# EAGLE schematic STM32 Feather (EAGLE 9.2.2)

## Sheet 1 of 3: Black Magic Probe
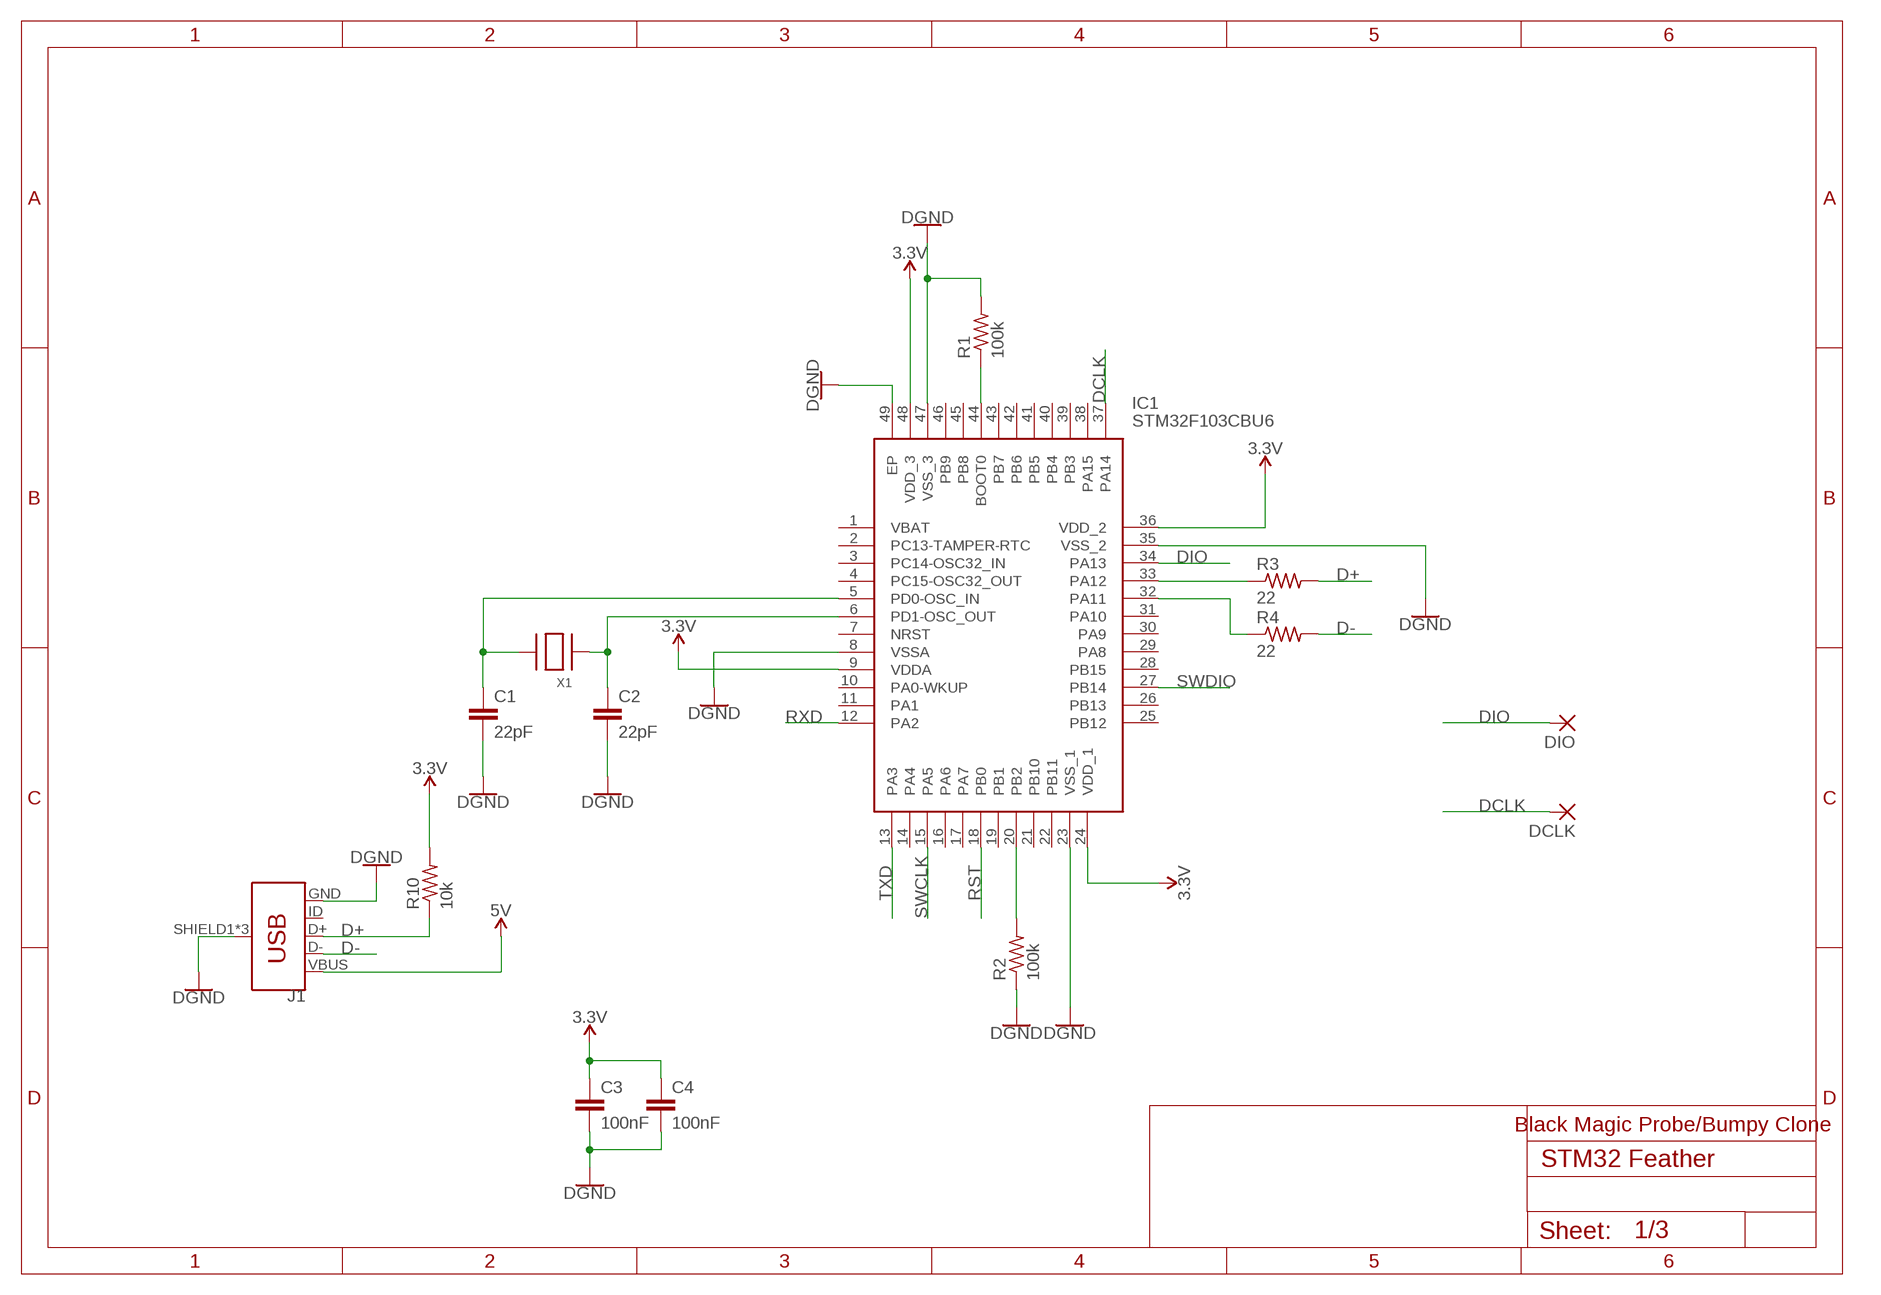
[diagram p0: schematic, sheet 1]

### Parts
C1  22pF  C-EUC0603  [C0603]
C2  22pF  C-EUC0603  [C0603]
C3  100nF  C-EUC0603  [C0603]
C4  100nF  C-EUC0603  [C0603]
DCLK  SMD2  [SMD1,27-2,54]
DIO  SMD2  [SMD1,27-2,54]
IC1  STM32F103CBU6  [QFN50P700X700X65-49N]
J1  USB_MICRO-B_FEMALE-SMT  [USB-B-MICRO-SMD]
R1  100k  R-US_R0603  [R0603]
R2  100k  R-US_R0603  [R0603]
R3  22  R-US_R0603  [R0603]
R4  22  R-US_R0603  [R0603]
R10  10k  R-US_R0603  [R0603]
X1  XTALNX5032  [NX5032]

### Nets
3.3V: C3.1 C4.1 IC1.9(VDDA) IC1.24(VDD_1) IC1.36(VDD_2) IC1.48(VDD_3) R10.2 ; also sheet 2,3
5V: J1.VBUS ; also sheet 2,3
D+: J1.D+ R3.2 R10.1
D-: J1.D- R4.2
DCLK: DCLK.1(P) IC1.37(PA14)
DIO: DIO.1(P) IC1.34(PA13)
GND: C1.2 C2.2 C3.2 C4.2 IC1.8(VSSA) IC1.23(VSS_1) IC1.35(VSS_2) IC1.47(VSS_3) IC1.49(EP) J1.GND J1.SHIELD1(SHIELD) J1.SHIELD2(SHIELD) J1.SHIELD3(SHIELD) R1.2 R2.1 ; supply symbol labelled DGND ; also sheet 2,3
N$3: C1.1 IC1.5(PD0-OSC_IN) X1.P$2
N$4: C2.1 IC1.6(PD1-OSC_OUT) X1.P$1
N$5: IC1.44(BOOT0) R1.1
N$7: IC1.20(PB2) R2.2
N$8: IC1.33(PA12) R3.1
N$9: IC1.32(PA11) R4.1
RST: IC1.18(PB0) ; also sheet 2
RXD: IC1.12(PA2) ; also sheet 2
SWCLK: IC1.15(PA5) ; also sheet 2
SWDIO: IC1.27(PB14) ; also sheet 2
TXD: IC1.13(PA3) ; also sheet 2
Unconnected: IC1.1(VBAT) IC1.2(PC13-TAMPER-RTC) IC1.3(PC14-OSC32_IN) IC1.4(PC15-OSC32_OUT) IC1.7(NRST) IC1.10(PA0-WKUP) IC1.11(PA1) IC1.14(PA4) IC1.16(PA6) IC1.17(PA7) IC1.19(PB1) IC1.21(PB10) IC1.22(PB11) IC1.25(PB12) IC1.26(PB13) IC1.28(PB15) IC1.29(PA8) IC1.30(PA9) IC1.31(PA10) IC1.38(PA15) IC1.39(PB3) IC1.40(PB4) IC1.41(PB5) IC1.42(PB6) IC1.43(PB7) IC1.45(PB8) IC1.46(PB9) J1.ID

### Notes on the sheet
- Black Magic Probe/Bumpy Clone

## Sheet 2 of 3: MCU
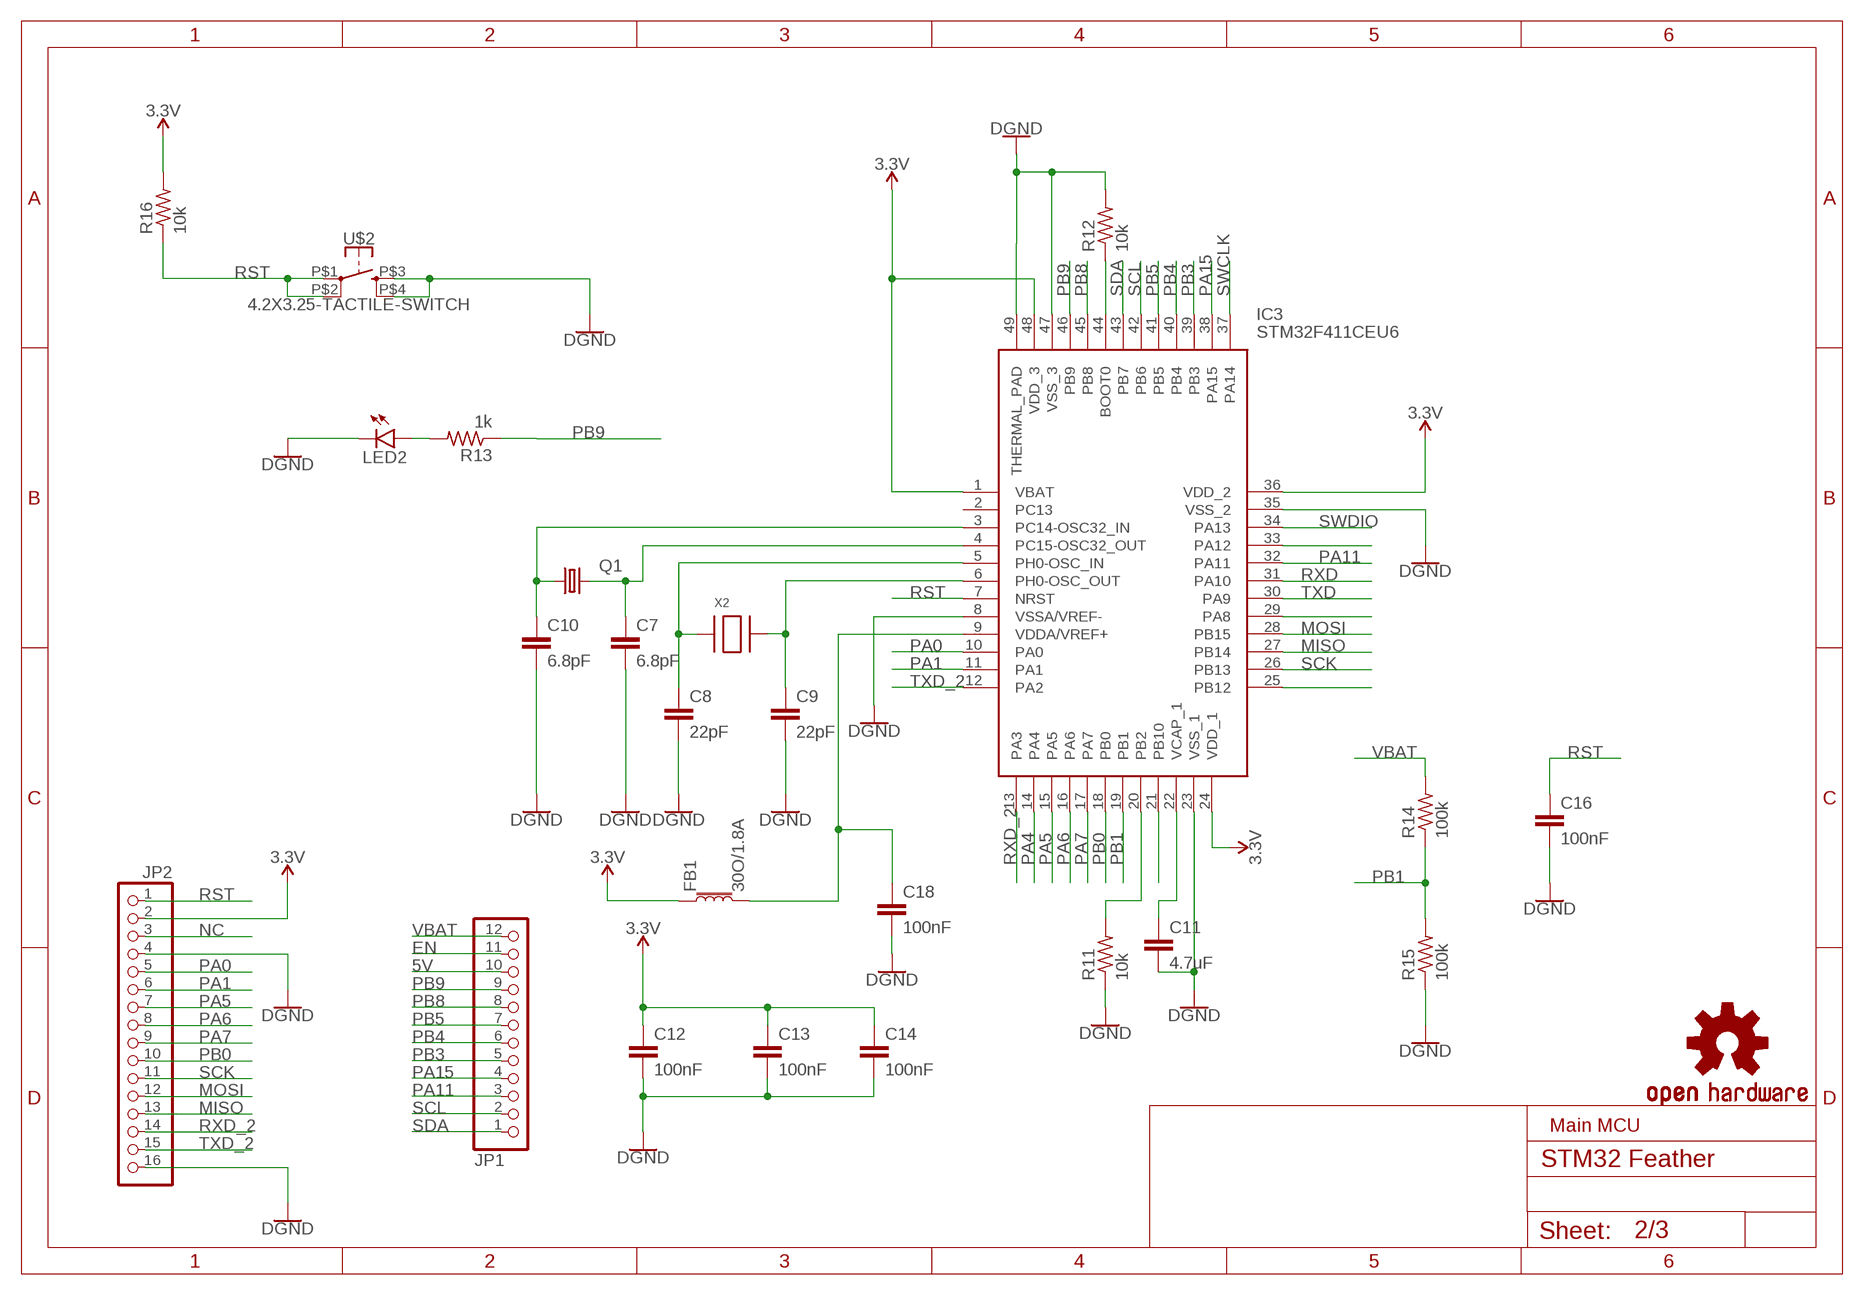
[diagram p1: schematic, sheet 2]

### Parts
C7  6.8pF  C-EUC0603  [C0603]
C8  22pF  C-EUC0603  [C0603]
C9  22pF  C-EUC0603  [C0603]
C10  6.8pF  C-EUC0603  [C0603]
C11  4.7uF  C-EUC0603  [C0603]
C12  100nF  C-EUC0603  [C0603]
C13  100nF  C-EUC0603  [C0603]
C14  100nF  C-EUC0603  [C0603]
C16  100nF  C-EUC0603  [C0603]
C18  100nF  C-EUC0603  [C0603]
FB1  30O/1.8A  FERRITE_BEAD-0603  [0603]
IC3  STM32F411CEU6  [QFN50P700X700X60-49N]
JP1  PINHD-1X12  [1X12]
JP2  PINHD-1X16  [1X16]
LED2  LEDCHIP-LED0603  [CHIP-LED0603]
LOGO1  OSHW-LOGOMINI  [OSHW-LOGO-MINI]
Q1  KX-327-NHF  [3.2X1.5]
R11  10k  R-US_R0603  [R0603]
R12  10k  R-US_R0603  [R0603]
R13  1k  R-US_R0603  [R0603]
R14  100k  R-US_R0603  [R0603]
R15  100k  R-US_R0603  [R0603]
R16  10k  R-US_R0603  [R0603]
U$2  4.2X3.25-TACTILE-SWITCH  [4.2X3.25]
X2  XTALNX5032  [NX5032]

### Nets
3.3V: C12.1 C13.1 C14.1 FB1.1 IC3.1(VBAT) IC3.24(VDD_1) IC3.36(VDD_2) IC3.48(VDD_3) JP2.2 R16.2 ; also sheet 1,3
5V: JP1.10 ; also sheet 1,3
EN: JP1.11
GND: C7.2 C8.2 C9.2 C10.2 C11.2 C12.2 C13.2 C14.2 C16.2 C18.2 IC3.8(VSSA/VREF-) IC3.23(VSS_1) IC3.35(VSS_2) IC3.47(VSS_3) IC3.49(THERMAL_PAD) JP2.4 JP2.16 LED2.C R11.1 R12.2 R15.1 U$2.P$3 U$2.P$4 ; supply symbol labelled DGND ; also sheet 1,3
MISO: IC3.27(PB14) JP2.13
MOSI: IC3.28(PB15) JP2.12
N$13: LED2.A R13.2
N$15: C7.1 IC3.4(PC15-OSC32_OUT) Q1.2
N$16: C10.1 IC3.3(PC14-OSC32_IN) Q1.1
N$17: C18.1 FB1.2 IC3.9(VDDA/VREF+)
N$18: C8.1 IC3.5(PH0-OSC_IN) X2.P$1
N$19: C9.1 IC3.6(PH0-OSC_OUT) X2.P$2
N$20: C11.1 IC3.22(VCAP_1)
N$21: IC3.20(PB2) R11.2
N$25: IC3.33(PA12)
N$27: IC3.29(PA8)
N$31: IC3.25(PB12)
N$33: IC3.44(BOOT0) R12.1
N$47: IC3.21(PB10)
NC: JP2.3
PA0: IC3.10(PA0) JP2.5
PA1: IC3.11(PA1) JP2.6
PA4: IC3.14(PA4)
PA5: IC3.15(PA5) JP2.7
PA6: IC3.16(PA6) JP2.8
PA7: IC3.17(PA7) JP2.9
PA11: IC3.32(PA11) JP1.3
PA15: IC3.38(PA15) JP1.4
PB0: IC3.18(PB0) JP2.10
PB1: IC3.19(PB1) R14.1 R15.2
PB3: IC3.39(PB3) JP1.5
PB4: IC3.40(PB4) JP1.6
PB5: IC3.41(PB5) JP1.7
PB8: IC3.45(PB8) JP1.8
PB9: IC3.46(PB9) JP1.9 R13.1
RST: C16.1 IC3.7(NRST) JP2.1 R16.1 U$2.P$1 U$2.P$2 ; also sheet 1
RXD: IC3.31(PA10) ; also sheet 1
RXD_2: IC3.13(PA3) JP2.14
SCK: IC3.26(PB13) JP2.11
SCL: IC3.42(PB6) JP1.2
SDA: IC3.43(PB7) JP1.1
SWCLK: IC3.37(PA14) ; also sheet 1
SWDIO: IC3.34(PA13) ; also sheet 1
TXD: IC3.30(PA9) ; also sheet 1
TXD_2: IC3.12(PA2) JP2.15
VBAT: JP1.12 R14.2 ; also sheet 3
Unconnected: IC3.2(PC13)

### Notes on the sheet
- Main MCU

## Sheet 3 of 3: Power
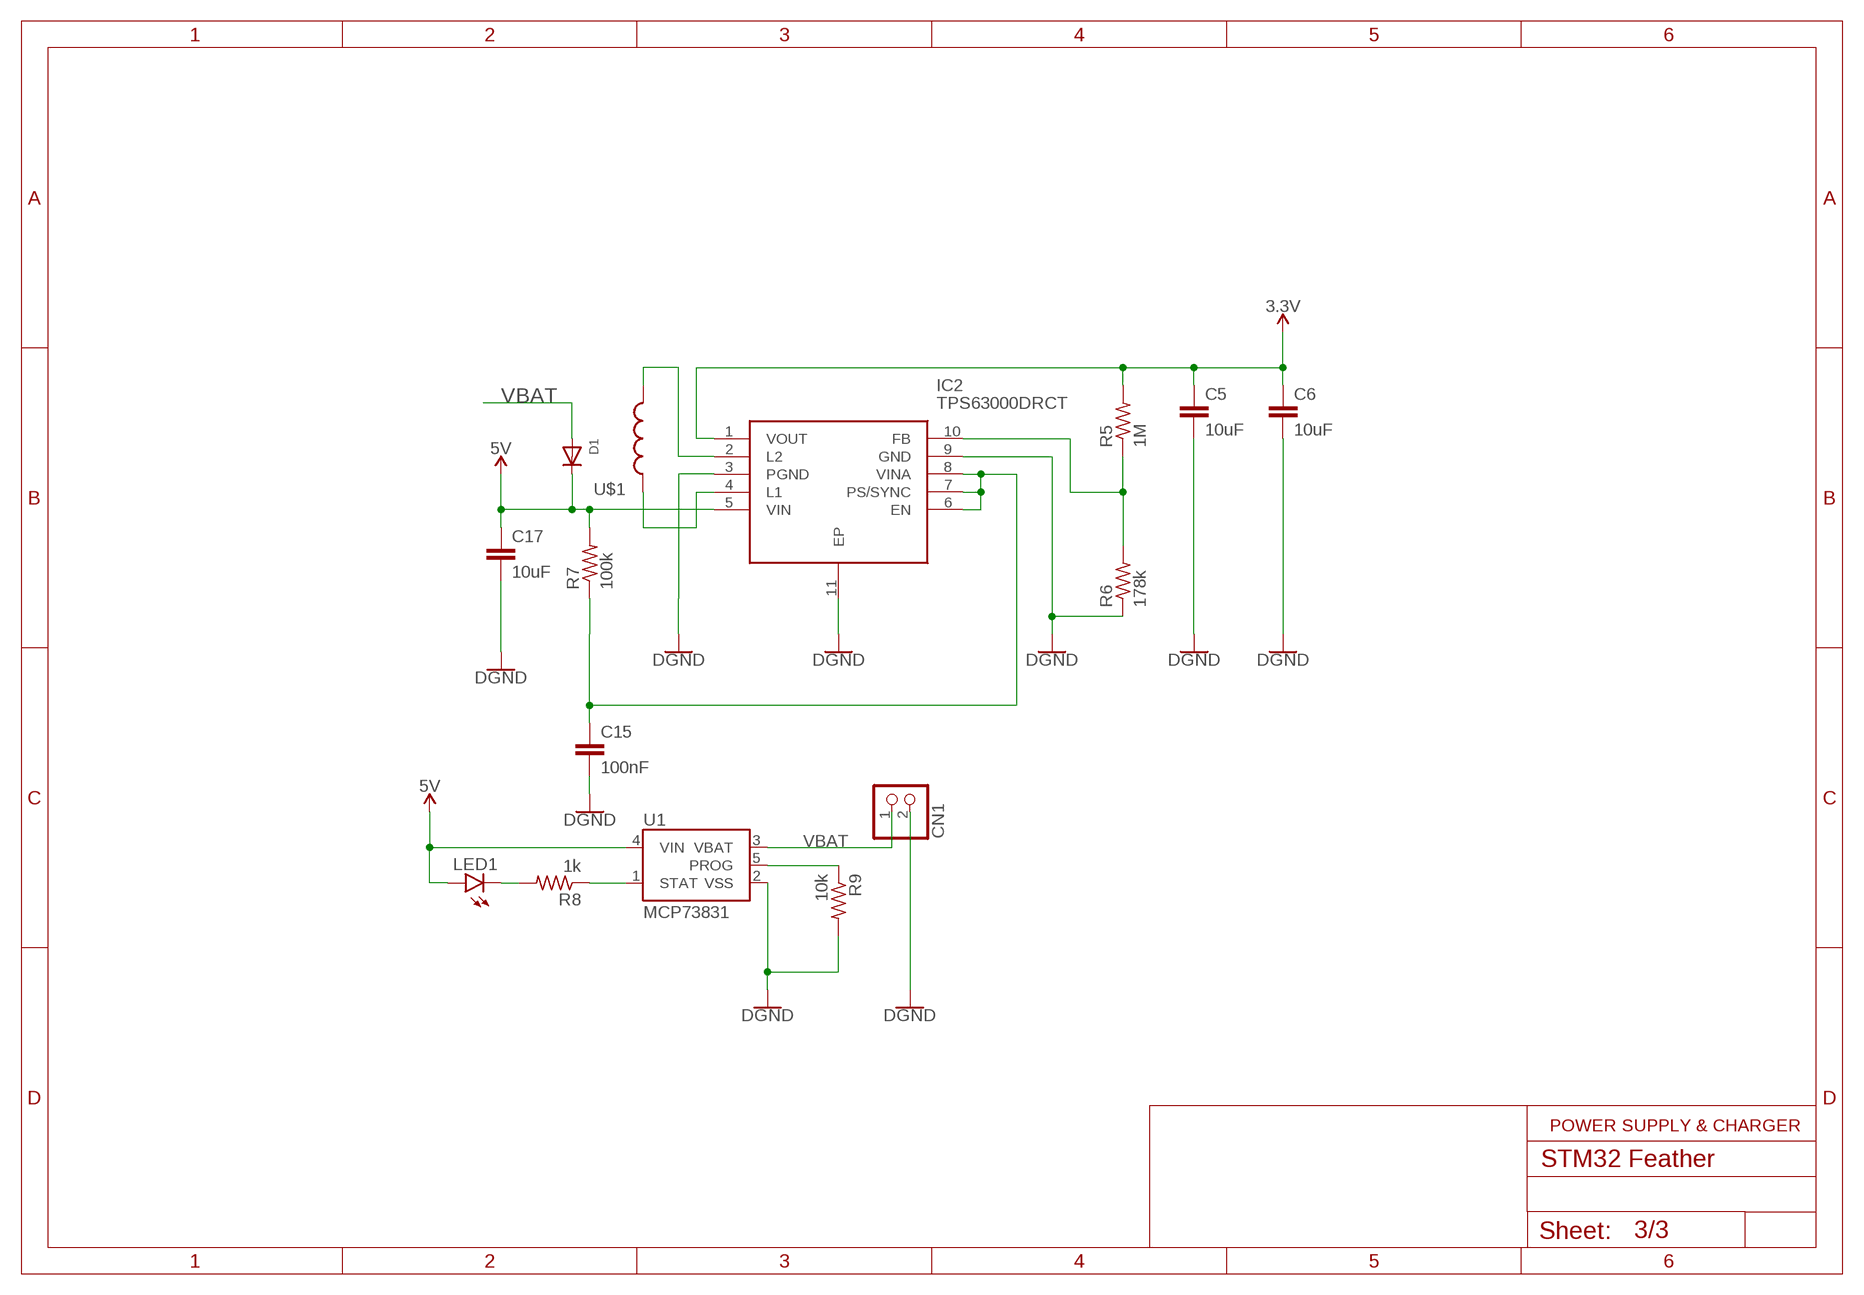
[diagram p2: schematic, sheet 3]

### Parts
C5  10uF  C-EUC0805  [C0805]
C6  10uF  C-EUC0603  [C0603]
C15  100nF  C-EUC0603  [C0603]
C17  10uF  C-EUC0603  [C0603]
CN1  JST_2PIN-THM-RA  [JST-PH-2-THM-RA]
D1  DIODESOD-123  [SOD-123]
IC2  TPS63000DRCT  [SON50P300X300X100-11N]
LED1  LEDCHIPLED_0603  [CHIPLED_0603]
R5  1M  R-US_R0603  [R0603]
R6  178k  R-US_R0603  [R0603]
R7  100k  R-US_R0603  [R0603]
R8  1k  R-US_R0603  [R0603]
R9  10k  R-US_R0603  [R0603]
U1  MCP73831  [SOT23-5]
U$1  SWPA252012S-INDUCTOR  [SWPA25012S]

### Nets
3.3V: C5.1 C6.1 IC2.1(VOUT) R5.2 ; also sheet 1,2
5V: C17.1 D1.C IC2.5(VIN) LED1.A R7.2 U1.4(VIN) ; also sheet 1,2
GND: C5.2 C6.2 C15.2 C17.2 CN1.2 IC2.3(PGND) IC2.9(GND) IC2.11(EP) R6.1 R9.2 U1.2(VSS) ; supply symbol labelled DGND ; also sheet 1,2
N$1: C15.1 IC2.6(EN) IC2.7(PS/SYNC) IC2.8(VINA) R7.1
N$2: IC2.2(L2) U$1.P$2
N$6: IC2.4(L1) U$1.P$1
N$10: LED1.C R8.2
N$11: R8.1 U1.1(STAT)
N$12: R9.1 U1.5(PROG)
N$14: IC2.10(FB) R5.1 R6.2
VBAT: CN1.1 D1.A U1.3(VBAT) ; also sheet 2

### Notes on the sheet
- POWER SUPPLY & CHARGER

## Library data of the parts
C1-C18 = rcl:C-EU: CAPACITOR, European symbol; SPICEPREFIX: C
CN1 = adafruit:JST_2PIN: JST 2-Pin Connectors of various flavors SMT-RA (S2B-PH-SM4) 4UConnector #17311 SMT (B2B-PH-SM4) THM-RA (S2B-PH) THM (B2B-PH)
D1 = adafruit:DIODE: Diode SMADIODE - SMA Surface Mount Package 20V 1A Schottky Diode Digikey: 641-1014-6-ND DO-1N4148 - Through Hole Small Current Diode SOD-123 20V 1 A (.5mV Vf) Schottky Diode - Digikey: MBRX120TPMSCT-ND SOD-323 10V 570mA (.38mV Vf, 3ns) Schottky Diode - Digikey: ZLLS410CT-ND SOD-523 30V 30mA Schottky Diode (RB751S-40TE61) - Digikey: RB751S-40TE61CT-ND SOT23-R/W - SOT23 Package (R = Solder Paste/Reflow Ovens, W = Hand-Soldering) BAT54Film 40V 300mA - Digikey: 497-7162-1-ND
DCLK DIO = wirepad:SMD2: SMD PAD
FB1 = SPEAR:FERRITE_BEAD: Ferrite Bead (blocks, cores, rings, chokes, etc.) Inductor with layers of ferrite used to suppress high frequencies. Often used to isolate high frequency noise. SparkFun Products: IOIO-OTG - V2.2 <https://www.sparkfun.com/products/13613> SparkFun SAMD21 Mini Breakout <https://www.sparkfun.com/products/13664> SparkFun 6 Degrees of Freedom Breakout - LSM6DS3 <https://www.sparkfun.com/products/13339> SparkFun SAMD21 Dev Breakout <https://www.sparkfun.com/products/13672>; PROD_ID: NDUC-13805
IC1 = LCSC:STM32F103CBU6: Source: Datasheet <http://www.st.com/web/en/resource/technical/document/datasheet/CD00161566.pdf>; ALLIED_NUMBER: 70521209; ALLIED_PRICE-STOCK: http://www.alliedelec.com/stmicroelectronics-stm32f103cbu6/70521209/; HEIGHT: 0.65mm; MANUFACTURER_NAME: STMicroelectronics; MANUFACTURER_PART_NUMBER: STM32F103CBU6; MOUSER_PART_NUMBER: 511-STM32F103CBU6; MOUSER_PRICE-STOCK: https://www.mouser.com/Search/Refine.aspx?Keyword=511-STM32F103CBU6; RS_PART_NUMBER: 1687243; RS_PRICE-STOCK: http://uk.rs-online.com/web/p/products/1687243
IC2 = LCSC:TPS63000DRCT: TPS63000DRCT Buck/Boost Converter, 1.2A, Adjustable, 1.2 5.5 V, 1500 kHz, 10-Pin SON EP Source: Datasheet <http://www.ti.com/lit/ds/symlink/tps63000.pdf>; DESCRIPTION: TPS63000DRCT Buck/Boost Converter, 1.2A, Adjustable, 1.2 5.5 V, 1500 kHz, 10-Pin SON EP; HEIGHT: 1mm; MANUFACTURER_NAME: Texas Instruments; MANUFACTURER_PART_NUMBER: TPS63000DRCT; MOUSER_PART_NUMBER: 595-TPS63000DRCT; MOUSER_PRICE-STOCK: https://www.mouser.com/Search/Refine.aspx?Keyword=595-TPS63000DRCT; RS_PART_NUMBER: 0389334P; RS_PRICE-STOCK: http://uk.rs-online.com/web/p/products/0389334P
IC3 = LCSC:STM32F411CEU6: 32-Bit MCU 512K Flash 100MHz UFQFPN48 STMicroelectronics STM32F411CEU6, 32bit ARM Cortex M4 MCU, 100MHz, 512 kB Flash, 48-Pin UFQFPN Source: Datasheet <https://www.arrow.com/en/products/stm32f411ceu6/stmicroelectronics>; ARROW_PART_NUMBER: STM32F411CEU6; DESCRIPTION: 32-Bit MCU 512K Flash 100MHz UFQFPN48 STMicroelectronics STM32F411CEU6, 32bit ARM Cortex M4 MCU, 100MHz, 512 kB Flash, 48-Pin UFQFPN; HEIGHT: 0.6mm; MANUFACTURER_NAME: STMicroelectronics; MANUFACTURER_PART_NUMBER: STM32F411CEU6
J1 = SparkFun-Connectors:USB_MICRO-B: USB Type Micro-B Connector Male/female and PTH/SMT variants SparkFun Products: SparkFun microB USB Breakout <https://www.sparkfun.com/products/12035> SparkFun USB microB Plug Breakout <https://www.sparkfun.com/products/10031> SparkFun ESP8266 Thing <https://www.sparkfun.com/products/13231>; PROD_ID: CONN-11752
JP1 = pinhead:PINHD-1X12: PIN HEADER
JP2 = pinhead:PINHD-1X16: PIN HEADER
LED1 LED2 = led:LED: LED OSRAM: - CHIPLED LG R971, LG N971, LY N971, LG Q971, LY Q971, LO R971, LY R971 LH N974, LH R974 LS Q976, LO Q976, LY Q976 LO Q996 - Hyper CHIPLED LW Q18S LB Q993, LB Q99A, LB R99A - SideLED LS A670, LO A670, LY A670, LG A670, LP A670 LB A673, LV A673, LT A673, LW A673 LH A674 LY A675 LS A676, LA A676, LO A676, LY A676, LW A676 LS A679, LY A679, LG A679 - Hyper Micro SIDELED® LS Y876, LA Y876, LO Y876, LY Y876 LT Y87S - SmartLED LW L88C, LW L88S LB L89C, LB L89S, LG L890 LS L89K, LO L89K, LY L89K LS L896, LA L896, LO L896, LY L896 - TOPLED LS T670, LO T670, LY T670, LG T670, LP T670 LSG T670, LSP T670, LSY T670, LOP T670, LYG T670 LG T671, LOG T671, LSG T671 LB T673, LV T673, LT T673, LW T673 LH T674 LS T676, LA T676, LO T676, LY T676, LB T676, LH T676, LSB T676, LW T676 LB T67C, LV T67C, LT T67C, LS T67K, LO T67K, LY T67K, LW E67C LS E67B, LA E67B, LO E67B, LY E67B, LB E67C, LV E67C, LT E67C LW T67C LS T679, LY T679, LG T679 LS T770, LO T770, LY T770, LG T770, LP T770 LB T773, LV T773, LT T773, LW T773 LH T774 LS E675, LA E675, LY E675, LS T675 LS T776, LA T776, LO T776, LY T776, LB T776 LHGB T686 LT T68C, LB T68C - Hyper Mini TOPLED® LB M676 - Mini TOPLED Santana® LG M470 LS M47K, LO M47K, LY M47K Source: http://www.osram.convergy.de LUXEON: - LUMILED® LXK2-PW12-R00, LXK2-PW12-S00, LXK2-PW14-U00, LXK2-PW14-V00 LXK2-PM12-R00, LXK2-PM12-S00, LXK2-PM14-U00 LXK2-PE12-Q00, LXK2-PE12-R00, LXK2-PE12-S00, LXK2-PE14-T00, LXK2-PE14-U00 LXK2-PB12-K00, LXK2-PB12-L00, LXK2-PB12-M00, LXK2-PB14-N00, LXK2-PB14-P00, LXK2-PB14-Q00 LXK2-PR12-L00, LXK2-PR12-M00, LXK2-PR14-Q00, LXK2-PR14-R00 LXK2-PD12-Q00, LXK2-PD12-R00, LXK2-PD12-S00 LXK2-PH12-R00, LXK2-PH12-S00 LXK2-PL12-P00, LXK2-PL12-Q00, LXK2-PL12-R00 Source: www.luxeon.com KINGBRIGHT: KA-3528ASYC Source: www.kingbright.com
LOGO1 = SparkFun-Aesthetics:OSHW-LOGO: Open-Source Hardware (OSHW) Logo This logo indicates the piece of hardware it is found on incorporates a OSHW license and/or adheres to the definition of open source hardware found here: http://freedomdefined.org/OSHW
Q1 = crystal-geyer_V1_0:KX-327: Tuning Fork Crystals (kHz) SMD: KX327 - Serie Model Size l/w/h [mm] Frequency Range Frequency Stability Temp. Range [°C] Load Capacitance AECQ 200 availabel Datasheet KX-327VT KX-327FT KX-327RT KX-327NHT KX-327NHF KX-327L KX-327S 1.25/1.05/0.5 1.6/1.0/0.5 2.0/1.2/0.6 3.2/1.5/0.8 3.2/1.5/0.8 7.0/1.5/1.4 8.2/3.8/2.5 32,768 kHz 32,768 kHz 32,768 kHz 32,768 kHz 32,768 kHz 32,768 kHz 32,768 kHz ±10 … ±20ppm ±10 … ±20ppm ±10 … ±20ppm ±10 … ±20ppm ±10 … ±20ppm ±10 … ±20ppm ±5 … ±20ppm (*) -40°C …+85°C (*) -40°C …+85°C (*) -40°C …+85°C (*) -40°C …+85°C (*) -40°C …+125°C (*) -40°C …+85°C (*) -40°C …+85°C 7/9/12,5 7/9/12,5 7/9/12,6 7/9/12,5 9/12,5 7/9/12,5 6/12,5 - - - - yes - - KX-327VT.pdf <http://www.geyer-electronic.de/uploads/tx_userartikelfrequenz/GEYER-KX-327VT.pdf> KX-327FT.pdf <http://www.geyer-electronic.de/uploads/tx_userartikelfrequenz/GEYER-KX-327FT.pdf> KX-327RT.pdf <http://www.geyer-electronic.de/uploads/tx_userartikelfrequenz/GEYER-KX-327RT.pdf> KX-327NHT.pdf <http://www.geyer-electronic.de/uploads/tx_userartikelfrequenz/GEYER-KX-327NHT.pdf> KX-327NHF.pdf <http://www.geyer-electronic.de/uploads/tx_userartikelfrequenz/GEYER-KX-327NHF.pdf> KX-327L.pdf <http://www.geyer-electronic.de/uploads/tx_userartikelfrequenz/GEYER-KX-327L.pdf> KX-327S.pdf <http://www.geyer-electronic.de/uploads/tx_userartikelfrequenz/GEYER-KX-327S.pdf> <http://www.geyer-electronic.de/fileadmin/template/img/logo-geyer-electronic.png> Details see: http://www.geyer-electronic.de/Frequenz-Produkte.9.0.html Created 2016-06-07, Hans Locher 2016 (C) Geyer Quartz Technology KX327VT,KX327FT,KX327RT,KX327NHT,KX327NHF,KX327S,KX327L;125105;1610;2012;3215;7015;8238;1,25x1,05,1.25x1.05;1,6x1,0,1.6x1.0;2,0x1,2,2.0x1.2;3,2x1,5,3.2x1.5;8,2x3,8,8.2x3.8,7.0x1.5,7,0x1,532.768kHz
R1-R16 = rcl:R-US_: RESISTOR, American symbol; SPICEPREFIX: R
U1 = SparkFun-IC-Power:MCP73831: MCP73831T Li-Ion, Li-Pol Controller Miniature single cell, fully integrated Li-Ion, Li-polymer charge management controller Datasheet <http://ww1.microchip.com/downloads/en/DeviceDoc/20001984g.pdf> SparkFun Products: SparkFun ESP32 Thing <https://www.sparkfun.com/products/13907> SparkFun 9DoF Razor IMU M0 <https://www.sparkfun.com/products/14001>; PROD_ID: IC-09995
U$1 = LCSC:SWPA252012S-INDUCTOR
U$2 = LCSC:4.2X3.25-TACTILE-SWITCH
X1 X2 = adafruit:XTAL: Low cost SMT crystals, no capacitors included http://www.ladyada.net/library/eagle